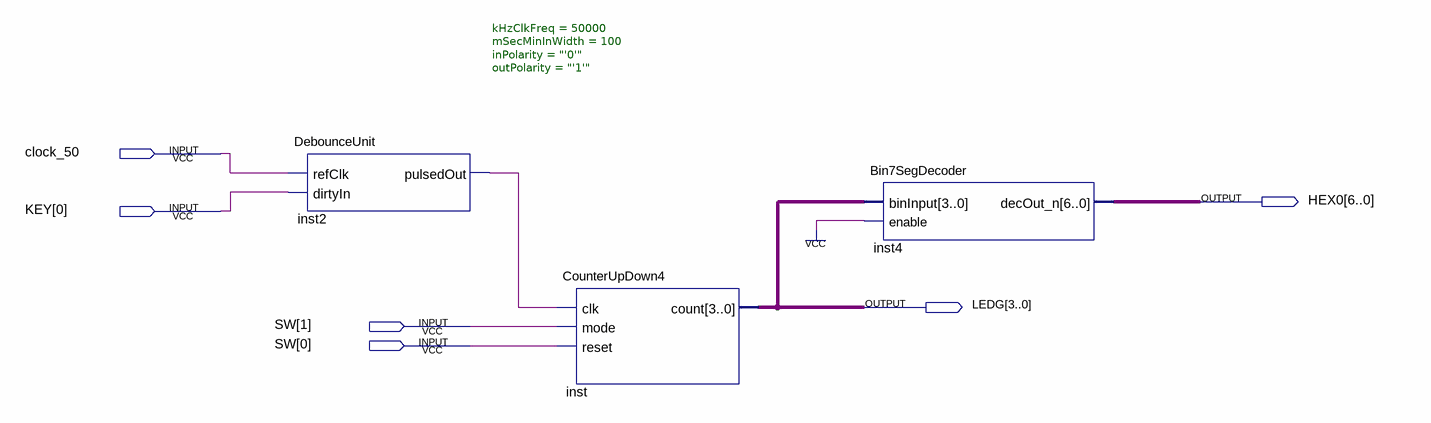
[diagram p0: schematic sheet]
// Quartus schematic Counter_Demo.bdf as structural Verilog: 3 symbols, 6 pins
module Counter_Demo (
  input  clock_50,
  input  [0:0] KEY,
  input  [1:0] SW,
  output [6:0] HEX0,
  output [3:0] LEDG
);

  wire inst2_pulsedout;

  DebounceUnit #(.kHzClkFreq(50000), .mSecMinInWidth(100), .inPolarity("'0'"), .outPolarity("'1'")) inst2 (
    .refClk(clock_50), .dirtyIn(KEY[0]), .pulsedOut(inst2_pulsedout));
  CounterUpDown4 inst (.clk(inst2_pulsedout), .mode(SW[1]), .reset(SW[0]), .count(LEDG));
  Bin7SegDecoder inst4 (.binInput(LEDG), .enable(1'b1), .decOut_n(HEX0));
endmodule
